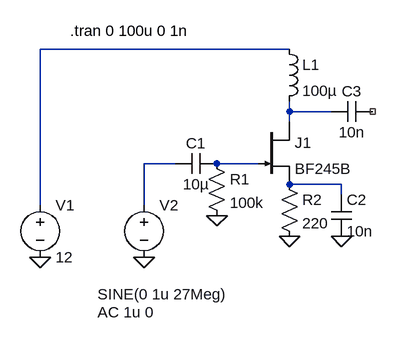
[diagram p0: schematic BF245B 20m Preamp.asc]
BF245B 20m Preamp.asc, the LTspice schematic file:
Version 4
SHEET 1 880 680
WIRE 176 -80 -208 -80
WIRE 176 16 176 0
WIRE 240 16 176 16
WIRE 176 32 176 16
WIRE 0 96 -48 96
WIRE 128 96 64 96
WIRE 256 128 176 128
WIRE 256 144 256 128
WIRE -208 160 -208 -80
WIRE -48 160 -48 96
FLAG -208 240 0
FLAG -48 240 0
FLAG 64 176 0
FLAG 176 208 0
FLAG 256 208 0
SYMBOL voltage -208 144 R0
SYMATTR InstName V1
SYMATTR Value 12
SYMBOL voltage -48 144 R0
WINDOW 3 -72 153 Left 0
WINDOW 123 -72 181 Left 0
WINDOW 39 0 0 Left 0
SYMATTR InstName V2
SYMATTR Value SINE(0 1u 27Meg)
SYMATTR Value2 AC 1u 0
SYMBOL cap 64 80 R90
WINDOW 0 0 32 VBottom 0
WINDOW 3 32 32 VTop 0
SYMATTR InstName C1
SYMATTR Value 10µ
SYMBOL res 48 80 R0
SYMATTR InstName R1
SYMATTR Value 100k
SYMBOL njf 128 32 R0
SYMATTR InstName J1
SYMATTR Value BF245B
SYMBOL res 160 112 R0
SYMATTR InstName R2
SYMATTR Value 220
SYMBOL cap 240 144 R0
SYMATTR InstName C2
SYMATTR Value 10n
SYMBOL cap 304 0 R90
WINDOW 0 0 32 VBottom 0
WINDOW 3 32 32 VTop 0
SYMATTR InstName C3
SYMATTR Value 10n
SYMBOL ind 160 -96 R0
SYMATTR InstName L1
SYMATTR Value 100µ
TEXT -162 -108 Left 0 !.tran 0 100u 0 1n

The netlist it stands for:
* BF245B 20m Preamp.asc
V1 N001 0 12
V2 N003 0 SINE(0 1u 27Meg) AC 1u 0
C1 N004 N003 10µ
R1 N004 0 100k
J1 N002 N004 N005 BF245B
R2 N005 0 220
C2 N005 0 10n
C3 NC_01 N002 10n
L1 N001 N002 100µ
.model NJF NJF
.model PJF PJF
.lib standard.jft
.tran 0 100u 0 1n
.backanno
.end